# Altium schematic sheet [2] MCU.SchDoc
size A3; Author: Caner ALP; Organization: ALP Electronics; Address1: Axel Oxenstiernas; Address2: Västerås; Address3: 72478; Address4: Sweden; DocumentNumber: 2; SheetNumber: 2; SheetTotal: 7
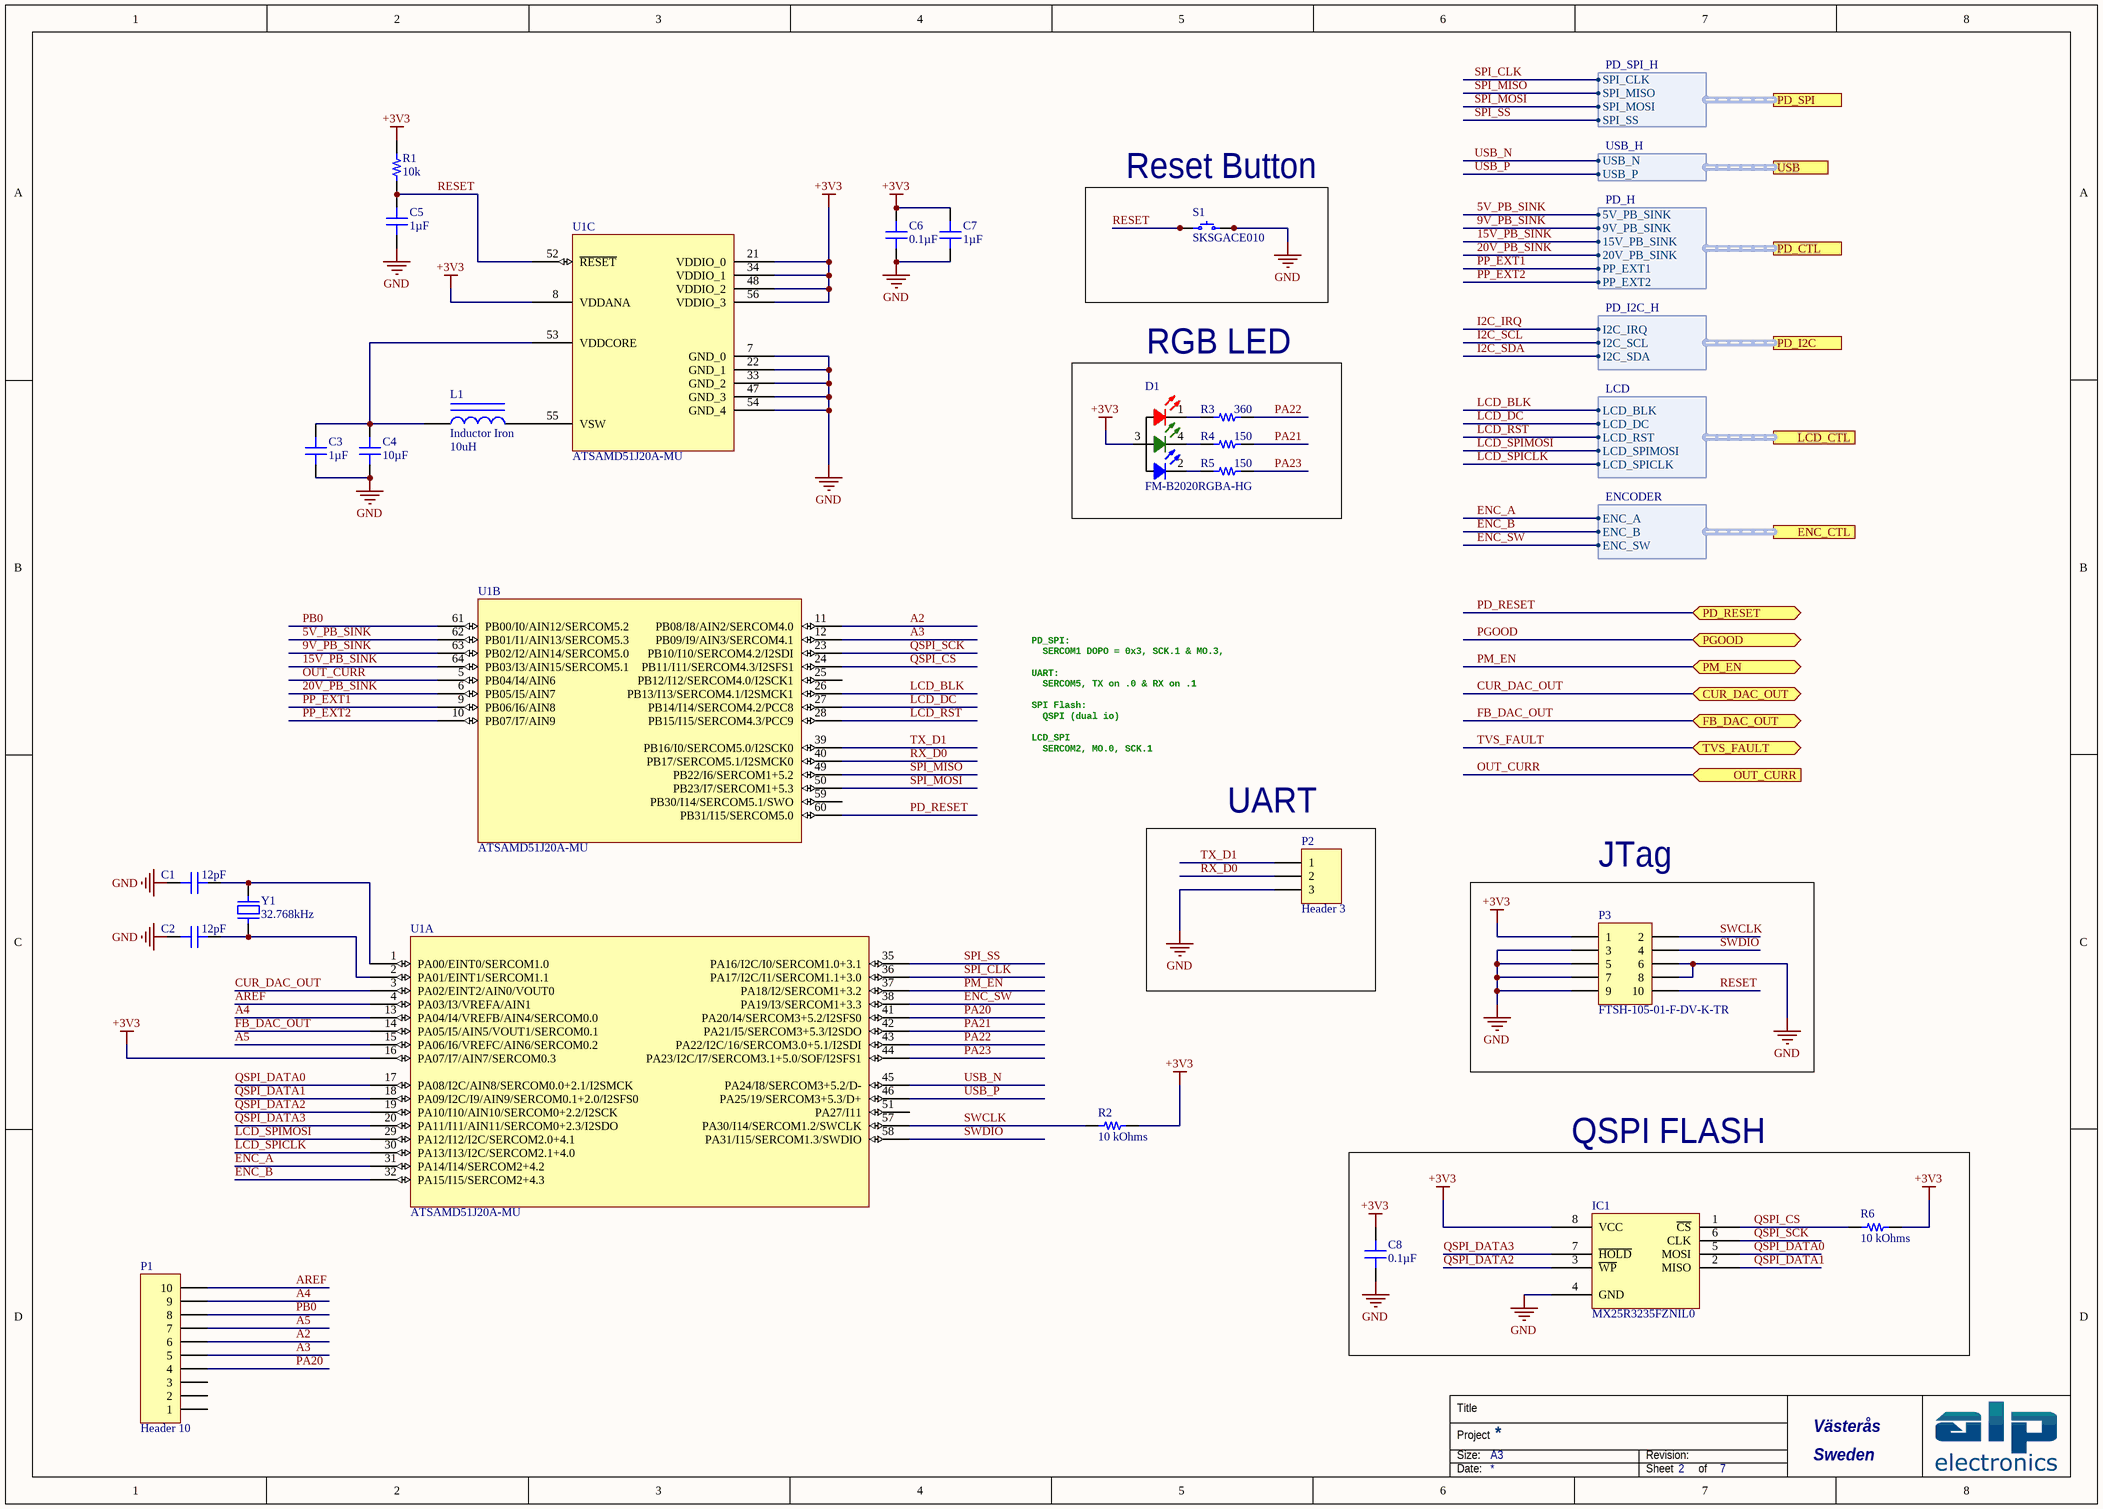
[diagram p0: [2] MCU.SchDoc]

## Parts
C1  12pF  [CAP 0603_1608]
C2  12pF  [CAP 0603_1608]
C3  1µF  [CAP 0603_1608]
C4  10µF  [CAP 0603_1608]
C5  1µF  [CAP 0603_1608]
C6  0.1µF  [CAP 0603_1608]
C7  1µF  [CAP 0603_1608]
C8  0.1µF  [CAP 0603_1608]
D1  FM-B2020RGBA-HG  [FM-B2020RGBA-HG]
IC1  MX25R3235FZNIL0  [SPANSION WSON-8 6x5MM]
L1  Inductor Iron  value 10uH  [IND_Würth_74404020100]
P1  Header 10  [HDR1X10]
P2  Header 3  [HDR1X3]
P3  FTSH-105-01-F-DV-K-TR  [FTSH-105-01-F-DV-K-TR]
R1  10k  [RES 0603/1608]
R2  10 kOhms  [RES 0603_1608]
R3  360  [RES 0603/1608]
R4  150  [RES 0603/1608]
R5  150  [RES 0603/1608]
R6  10 kOhms  [RES 0603_1608]
S1  SKSGACE010  [SKSGACE010]
U1  ATSAMD51J20A-MU  [SI LABS QFN-64_S]  (parts A,B,C of 3)
Y1  32.768kHz  [ABRACON ABS07]

## Blocks framed on the sheet
Reset Button: S1
RGB LED: D1 R3-R5
UART: P2
JTag: P3
QSPI FLASH: C8 IC1 R6

## Ports
CUR_DAC_OUT (bidir), ENC_CTL (harness ENCODER), FB_DAC_OUT (bidir), LCD_CTL (harness LCD), OUT_CURR (in), PD_CTL (harness PD_H), PD_I2C (harness PD_I2C_H), PD_RESET (bidir), PD_SPI (harness PD_SPI_H), PGOOD (bidir), PM_EN (bidir), TVS_FAULT (bidir), USB (harness USB_H)

## Harnesses
USB_H: USB_N, USB_P
PD_H: 5V_PB_SINK, 9V_PB_SINK, 15V_PB_SINK, 20V_PB_SINK, PP_EXT1, PP_EXT2
PD_SPI_H: SPI_CLK, SPI_MISO, SPI_MOSI, SPI_SS
PD_I2C_H: I2C_IRQ, I2C_SCL, I2C_SDA
LCD: LCD_BLK, LCD_DC, LCD_RST, LCD_SPIMOSI, LCD_SPICLK
ENCODER: ENC_A, ENC_B, ENC_SW

## Nets
+3V3: C6.1 C7.2 C8.1 D1.3 IC1.8(VCC) P3.1 R1.2 R2.2 R6.2 U1.8(VDDANA) U1.16(PA07/I7/AIN7/SERCOM0.3) U1.21(VDDIO_0) U1.34(VDDIO_1) U1.48(VDDIO_2) U1.56(VDDIO_3)
GND: C1.1 C2.1 C3.1 C4.1 C5.1 C6.2 C7.1 C8.2 IC1.4(GND) P2.3 P3.3 P3.5 P3.6 P3.7 P3.8 P3.9 S1.3 S1.4 U1.7(GND_0) U1.22(GND_1) U1.33(GND_2) U1.47(GND_3) U1.54(GND_4)
5V_PB_SINK: U1.62(PB01/I1/AIN13/SERCOM5.3) ; port PD_CTL.5V_PB_SINK
9V_PB_SINK: U1.63(PB02/I2/AIN14/SERCOM5.0) ; port PD_CTL.9V_PB_SINK
15V_PB_SINK: U1.64(PB03/I3/AIN15/SERCOM5.1) ; port PD_CTL.15V_PB_SINK
20V_PB_SINK: U1.6(PB05/I5/AIN7) ; port PD_CTL.20V_PB_SINK
A2: P1.6 U1.11(PB08/I8/AIN2/SERCOM4.0)
A3: P1.5 U1.12(PB09/I9/AIN3/SERCOM4.1)
A4: P1.9 U1.13(PA04/I4/VREFB/AIN4/SERCOM0.0)
A5: P1.7 U1.15(PA06/I6/VREFC/AIN6/SERCOM0.2)
AREF: P1.10 U1.4(PA03/I3/VREFA/AIN1)
CUR_DAC_OUT: U1.3(PA02/EINT2/AIN0/VOUT0) ; port CUR_DAC_OUT
ENC_A: U1.31(PA14/I14/SERCOM2+4.2) ; port ENC_CTL.ENC_A
ENC_B: U1.32(PA15/I15/SERCOM2+4.3) ; port ENC_CTL.ENC_B
ENC_SW: U1.38(PA19/I3/SERCOM1+3.3) ; port ENC_CTL.ENC_SW
FB_DAC_OUT: U1.14(PA05/I5/AIN5/VOUT1/SERCOM0.1) ; port FB_DAC_OUT
I2C_IRQ: port PD_I2C.I2C_IRQ
I2C_SCL: port PD_I2C.I2C_SCL
I2C_SDA: port PD_I2C.I2C_SDA
LCD_BLK: U1.26(PB13/I13/SERCOM4.1/I2SMCK1) ; port LCD_CTL.LCD_BLK
LCD_DC: U1.27(PB14/I14/SERCOM4.2/PCC8) ; port LCD_CTL.LCD_DC
LCD_RST: U1.28(PB15/I15/SERCOM4.3/PCC9) ; port LCD_CTL.LCD_RST
LCD_SPICLK: U1.30(PA13/I13/I2C/SERCOM2.1+4.0) ; port LCD_CTL.LCD_SPICLK
LCD_SPIMOSI: U1.29(PA12/I12/I2C/SERCOM2.0+4.1) ; port LCD_CTL.LCD_SPIMOSI
OUT_CURR: U1.5(PB04/I4/AIN6) ; port OUT_CURR
PA20: P1.4 U1.41(PA20/I4/SERCOM3+5.2/I2SFS0)
PA21: R4.2 U1.42(PA21/I5/SERCOM3+5.3/I2SDO)
PA22: R3.2 U1.43(PA22/I2C/16/SERCOM3.0+5.1/I2SDI)
PA23: R5.2 U1.44(PA23/I2C/I7/SERCOM3.1+5.0/SOF/I2SFS1)
PB0: P1.8 U1.61(PB00/I0/AIN12/SERCOM5.2)
PD_RESET: U1.60(PB31/I15/SERCOM5.0) ; port PD_RESET
PGOOD: port PGOOD
PM_EN: U1.37(PA18/I2/SERCOM1+3.2) ; port PM_EN
PP_EXT1: U1.9(PB06/I6/AIN8) ; port PD_CTL.PP_EXT1
PP_EXT2: U1.10(PB07/I7/AIN9) ; port PD_CTL.PP_EXT2
QSPI_CS: IC1.1(~{CS}) R6.1 U1.24(PB11/I11/SERCOM4.3/I2SFS1)
QSPI_DATA0: IC1.5(MOSI) U1.17(PA08/I2C/AIN8/SERCOM0.0+2.1/I2SMCK)
QSPI_DATA1: IC1.2(MISO) U1.18(PA09/I2C/I9/AIN9/SERCOM0.1+2.0/I2SFS0)
QSPI_DATA2: IC1.3(~{WP}) U1.19(PA10/I10/AIN10/SERCOM0+2.2/I2SCK)
QSPI_DATA3: IC1.7(~{HOLD}) U1.20(PA11/I11/AIN11/SERCOM0+2.3/I2SDO)
QSPI_SCK: IC1.6(CLK) U1.23(PB10/I10/SERCOM4.2/I2SDI)
RESET: C5.2 P3.10 R1.1 S1.1 S1.2 U1.52(~{RESET})
RX_D0: P2.2 U1.40(PB17/SERCOM5.1/I2SMCK0)
SPI_CLK: U1.36(PA17/I2C/I1/SERCOM1.1+3.0) ; port PD_SPI.SPI_CLK
SPI_MISO: U1.49(PB22/I6/SERCOM1+5.2) ; port PD_SPI.SPI_MISO
SPI_MOSI: U1.50(PB23/I7/SERCOM1+5.3) ; port PD_SPI.SPI_MOSI
SPI_SS: U1.35(PA16/I2C/I0/SERCOM1.0+3.1) ; port PD_SPI.SPI_SS
SWCLK: P3.2 R2.1 U1.57(PA30/I14/SERCOM1.2/SWCLK)
SWDIO: P3.4 U1.58(PA31/I15/SERCOM1.3/SWDIO)
TVS_FAULT: port TVS_FAULT
TX_D1: P2.1 U1.39(PB16/I0/SERCOM5.0/I2SCK0)
USB_N: U1.45(PA24/I8/SERCOM3+5.2/D-) ; port USB.USB_N
USB_P: U1.46(PA25/19/SERCOM3+5.3/D+) ; port USB.USB_P
NetC1_2: C1.2 U1.1(PA00/EINT0/SERCOM1.0) Y1.2
NetC2_2: C2.2 U1.2(PA01/EINT1/SERCOM1.1) Y1.1
NetC3_2: C3.2 C4.2 L1.1 U1.53(VDDCORE)
NetD1_1: D1.1 R3.1
NetD1_2: D1.2 R5.1
NetD1_4: D1.4 R4.1
NetL1_2: L1.2 U1.55(VSW)

Not connected (* = marked no-connect by the designer): P1 1 2 3; U1 25(PB12/I12/SERCOM4.0/I2SCK1) 51(PA27/I11) 59(PB30/I14/SERCOM5.1/SWO)

## Notes on the sheet
- PD_SPI:
  SERCOM1 DOPO = 0x3, SCK.1 & MO.3,
  UART:
  SERCOM5, TX on .0 & RX on .1
  SPI Flash:
  QSPI (dual io)
  LCD_SPI
  SERCOM2, MO.0, SCK.1
- Title
- Size:
- Project
- A3
- Revision:
- Date:
- Sheet
- of

## Library data of the parts
C1 C2 = 06031A120JAT4A: CAP CER 12PF 100V NP0 0603; Manufacturer: AVX Corporation; Temperature Coefficient: C0G, NP0; Tolerance: ±5%; Part Number: 06031A120JAT4A; Value: 12pF; Applications: General Purpose; Capacitance: 12pF; ComponentLink1Description: Datasheet; ComponentLink1URL: http://datasheets.avx.com/C0GNP0-Dielectric.pdf; ComponentLink2Description: DigiKey Link; ComponentLink2URL: http://digikey.com/product-detail/en/avx-corporation/06031A120JAT4A/478-10188-1-ND/6797488; Device Package: 0603 (1608 Metric); LastUpdated: 21/01/2020 00:01:49; Lifecycle Status: Active; Minimum Order: 1; Mounting Type: Surface Mount, MLCC; Operating Temperature: -55°C ~ 125°C; Package / Case: 0603 (1608 Metric); Packaging: TapeAndReel; PartId: 14161; Part Status: Active; Price: 0.01; Series: -; Size / Dimension: 0.063" L x 0.032" W (1.60mm x 0.81mm); Supplier 1: DigiKey; Supplier Part Number 1: 478-10188-1-ND; Thickness (Max): 0.035" (0.90mm); Voltage - Rated: 100V
C3 C5 = 06035C105KAT2A: CAP CER 1UF 50V X7R 0603; Manufacturer: AVX Corporation; Tolerance: ±10%; Part Number: 06035C105KAT2A; Value: 1µF; Applications: General Purpose; Capacitance: 1µF; ComponentLink1Description: Datasheet; ComponentLink1URL: http://datasheets.avx.com/X7RDielectric.pdf; ComponentLink2Description: DigiKey Link; ComponentLink2URL: http://digikey.com/product-detail/en/avx-corporation/06035C105KAT2A/478-10073-1-ND/6564295; Device Package: 0603 (1608 Metric); LastUpdated: 21/01/2020 00:02:08; Lifecycle Status: Active; Minimum Order: 1; Mounting Type: Surface Mount, MLCC; Operating Temperature: -55°C ~ 125°C; Package / Case: 0603 (1608 Metric); Packaging: TapeAndReel; PartId: 2905; Part Status: Active; Price: 0.15; Series: -; Size / Dimension: 0.063" L x 0.032" W (1.60mm x 0.81mm); Supplier 1: DigiKey; Supplier Part Number 1: 478-10073-1-ND; Temperature Coefficient: X7R; Thickness (Max): 0.020" (0.50mm); Voltage - Rated: 50V
C4 = 0603ZD106MAT2A: CAP CER 10UF 10V X5R 0603; Manufacturer: AVX Corporation; Tolerance: ±20%; Part Number: 0603ZD106MAT2A; Value: 10µF; Applications: General Purpose; Capacitance: 10µF; ComponentLink1Description: Datasheet; ComponentLink1URL: http://datasheets.avx.com/cx5r.pdf; ComponentLink2Description: DigiKey Link; ComponentLink2URL: http://digikey.com/product-detail/en/avx-corporation/0603ZD106MAT2A/478-8050-1-ND/3900666; Device Package: 0603 (1608 Metric); LastUpdated: 21/01/2020 00:01:55; Lifecycle Status: Active; Minimum Order: 1; Mounting Type: Surface Mount, MLCC; Operating Temperature: -55°C ~ 85°C; Package / Case: 0603 (1608 Metric); Packaging: TapeAndReel; PartId: 11464; Part Status: Active; Price: 0.18; Series: -; Size / Dimension: 0.063" L x 0.032" W (1.60mm x 0.81mm); Supplier 1: DigiKey; Supplier Part Number 1: 478-8050-1-ND; Temperature Coefficient: X5R; Thickness (Max): 0.035" (0.90mm); Voltage - Rated: 10V
C6 C8 = 0603BB104K500NGT: CAP CER 0.1UF 50V X7R 0603; Manufacturer: Knowles Novacap; Tolerance: ±10%; Part Number: 0603BB104K500NGT; Value: 0.1µF; Applications: General Purpose; Capacitance: 0.1µF; ComponentLink1Description: Datasheet; ComponentLink1URL: https://www.knowlescapacitors.com/getattachment/6c8d48ef-fc2b-4752-ae2c-ce6c208de0c4/High-Capacitance-Chip.aspx; ComponentLink2Description: DigiKey Link; ComponentLink2URL: http://digikey.com/product-detail/en/knowles-novacap/0603BB104K500NGT/1763-1146-1-ND/7304094; Device Package: 0603 (1608 Metric); Features: Gold Flash Termination; LastUpdated: 21/01/2020 00:02:02; Lifecycle Status: Active; Minimum Order: 1; Mounting Type: Surface Mount, MLCC; Operating Temperature: -55°C ~ 125°C; Package / Case: 0603 (1608 Metric); Packaging: TapeAndReel; PartId: 7006; Part Status: Active; Price: 0.56; Series: -; Size / Dimension: 0.060" L x 0.030" W (1.52mm x 0.76mm); Supplier 1: DigiKey; Supplier Part Number 1: 1763-1146-1-ND; Temperature Coefficient: X7R; Thickness (Max): 0.035" (0.89mm); Voltage - Rated: 50V
C7 = 0603BB105K160YT: CAP CER 1UF 16V X7R 0603; Manufacturer: Knowles Novacap; Tolerance: ±10%; Part Number: 0603BB105K160YT; Value: 1µF; Applications: General Purpose; Capacitance: 1µF; ComponentLink1Description: Datasheet; ComponentLink1URL: https://www.knowlescapacitors.com/getattachment/6c8d48ef-fc2b-4752-ae2c-ce6c208de0c4/High-Capacitance-Chip.aspx; ComponentLink2Description: DigiKey Link; ComponentLink2URL: http://digikey.com/product-detail/en/knowles-novacap/0603BB105K160YT/1763-1175-1-ND/7304294; Device Package: 0603 (1608 Metric); LastUpdated: 21/01/2020 00:02:02; Lifecycle Status: Active; Minimum Order: 1; Mounting Type: Surface Mount, MLCC; Operating Temperature: -55°C ~ 125°C; Package / Case: 0603 (1608 Metric); Packaging: TapeAndReel; PartId: 6996; Part Status: Active; Price: 0.51; Series: -; Size / Dimension: 0.060" L x 0.030" W (1.52mm x 0.76mm); Supplier 1: DigiKey; Supplier Part Number 1: 1763-1175-1-ND; Temperature Coefficient: X7R; Thickness (Max): 0.035" (0.89mm); Voltage - Rated: 16V
D1 = FM-B2020RGBA-HG: RGB 615~630nmRed,515~535nmGreen,465~480nmBlue 2020; Manufacturer: Foshan NationStar Optoelectronics; Value: Green; Type: Surface Mount; Part Number: FM-B2020RGBA-HG; PartId: 10872; Supplier 1: LCSC; Supplier Part Number 1: C108793; ComponentLink1Description: Datasheet; ComponentLink1URL: https://datasheet.lcsc.com/szlcsc/1810231210_Foshan-NationStar-Optoelectronics-FM-B2020RGBA-HG_C108793.pdf; ComponentLink2Description: LCSC Listing; ComponentLink2URL: https://lcsc.com/product-detail/Light-Emitting-Diodes-LED_FM-B2020RGBA-HG_C108793.html; Device Package: 2020; Colour: RGB
IC1 = S25FL116K0XNFI011: IC FLASH MEM 16MB SPI CMOS 8WSON; Manufacturer: Spansion; Memory Type: FLASH - NOR; Memory Size: 16M (2M x 8); Speed: 108MHz; Interface: SPI Serial; Voltage - Supply: 2.7 V ~ 3.6 V; Part Number: S25FL116K0XNFI011; PartId: 8258; Supplier 1: Digi-Key; Supplier Part Number 1: 1274-1131-ND; ComponentLink1Description: Datasheet; ComponentLink1URL: http://www.spansion.com/Support/Datasheets/S25FL1-K_00.pdf; ComponentLink2Description: Digi-Key Listing; ComponentLink2URL: http://www.digikey.com/product-detail/en/S25FL116K0XNFI011/1274-1131-ND/4517162; Price: 0,49; Type: FLASH - NOR; Device Package: 8-WDFN Exposed Pad; Operating Temperature: -40C ~ 85C
L1 = Inductor Iron: Magnetic-Core Inductor; Published: 24-Mar-1999; LatestRevisionDate: 17-Jul-2002; LatestRevisionNote: Re-released for DXP Platform.; PackageReference: AXIAL-0.9; Publisher: Altium Limited; PackageDescription: Axial Device, Thru-Hole; 2 Leads; 0.9 in Pin Spacing
P1 = Header 10: Header, 10-Pin; LatestRevisionDate: 17-Jul-2002; LatestRevisionNote: Re-released for DXP Platform.; Publisher: Altium Limited
P2 = Header 3: Header, 3-Pin; LatestRevisionDate: 17-Jul-2002; LatestRevisionNote: Re-released for DXP Platform.; Publisher: Altium Limited
P3 = Header 5X2: Header, 5-Pin, Dual row; LatestRevisionDate: 17-Jul-2002; LatestRevisionNote: Re-released for DXP Platform.; Publisher: Altium Limited
R1 = ERJ-3GEYJ103V: RES SMD 10K OHM 5% 1/10W 0603; Manufacturer: Panasonic Electronic Components; TemperatureRange: -55C ~ 155C; TemperatureCoefficient: 200ppm/C; PowerRating: 0.1W, 1/10W; Value: 10k; Part Number: ERJ-3GEYJ103V; PartId: 11175; Supplier 1: Digi-Key; Supplier Part Number 1: P10KGTR-ND; ComponentLink1Description: Datasheet; ComponentLink1URL: http://industrial.panasonic.com/www-cgi/jvcr13pz.cgi?E+PZ+3+AOA0001+ERJ3GEYJ103V+7+WW; ComponentLink2Description: Digi-Key Listing; ComponentLink2URL: https://www.digikey.com/product-detail/en/panasonic-electronic-components/ERJ-3GEYJ103V/P10KGTR-ND/135662; Tolerance: 5%; Price: 0.002; Device Package: 0603 (1608 Metric)
R2 R6 = CRCW060310K0JNEA: RES SMD 10K OHM 5% 1/10W 0603; Manufacturer: Vishay Dale; Power (Watts): 0.1W, 1/10W; Temperature Coefficient: ±200ppm/°C; Part Number: CRCW060310K0JNEA; Value: 10 kOhms; ComponentLink1Description: Datasheet; ComponentLink1URL: http://www.vishay.com/docs/20035/dcrcwe3.pdf; ComponentLink2Description: DigiKey Link; ComponentLink2URL: http://digikey.com/product-detail/en/vishay-dale/CRCW060310K0JNEA/541-10KGCT-ND/1179393; Composition: Thick Film; Device Package: 0603 (1608 Metric); Features: Automotive AEC-Q200; Height - Seated (Max): 0.020" (0.50mm); LastUpdated: 21/01/2020 00:24:50; Lifecycle Status: Active; Minimum Order: 1; Number of Terminations: 2; Operating Temperature: -55°C ~ 155°C; Package / Case: 0603 (1608 Metric); Packaging: CutTape; PartId: 5216; Part Status: Active; Price: 0.10; Ratings: AEC-Q200; Resistance: 10 kOhms; Series: CRCW; Size / Dimension: 0.063" L x 0.033" W (1.60mm x 0.85mm); Supplier 1: DigiKey; Supplier Part Number 1: 541-10KGCT-ND; Supplier Device Package: 0603; Tolerance: ±5%
R3 = ERJ-3GEYJ361V: RES SMD 360 OHM 5% 1/10W 0603; Manufacturer: Panasonic Electronic Components; TemperatureRange: -55C ~ 155C; TemperatureCoefficient: 200ppm/C; PowerRating: 0.1W, 1/10W; Value: 360; Part Number: ERJ-3GEYJ361V; PartId: 11239; Supplier 1: Digi-Key; Supplier Part Number 1: P360GTR-ND; ComponentLink1Description: Datasheet; ComponentLink1URL: http://industrial.panasonic.com/www-cgi/jvcr13pz.cgi?E+PZ+3+AOA0001+ERJ3GEYJ361V+7+WW; ComponentLink2Description: Digi-Key Listing; ComponentLink2URL: https://www.digikey.com/product-detail/en/panasonic-electronic-components/ERJ-3GEYJ361V/P360GTR-ND/135761; Tolerance: 5%; Price: 0.002; Device Package: 0603 (1608 Metric)
R4 R5 = ERJ-3GEYJ151V: RES SMD 150 OHM 5% 1/10W 0603; Manufacturer: Panasonic Electronic Components; TemperatureRange: -55C ~ 155C; TemperatureCoefficient: 200ppm/C; PowerRating: 0.1W, 1/10W; Value: 150; Part Number: ERJ-3GEYJ151V; PartId: 11200; Supplier 1: Digi-Key; Supplier Part Number 1: P150GTR-ND; ComponentLink1Description: Datasheet; ComponentLink1URL: http://industrial.panasonic.com/www-cgi/jvcr13pz.cgi?E+PZ+3+AOA0001+ERJ3GEYJ151V+7+WW; ComponentLink2Description: Digi-Key Listing; ComponentLink2URL: https://www.digikey.com/product-detail/en/panasonic-electronic-components/ERJ-3GEYJ151V/P150GTR-ND/135689; Tolerance: 5%; Price: 0.002; Device Package: 0603 (1608 Metric)
S1 = SKSGACE010: SWITCH TACTILE SPST-NO 0.05A 16V; Manufacturer: ALPS; Part Number: SKSGACE010; PartId: 16471; Supplier 1: Mouser; Supplier Part Number 1: 688-SKSGACE010; ComponentLink1Description: Datasheet; ComponentLink1URL: https://www.mouser.se/datasheet/2/15/SKSG-1370727.pdf; ComponentLink2Description: Mouser Listing; ComponentLink2URL: https://www.mouser.se/ProductDetail/ALPS/SKSGACE010?qs=Ptl%2FSkKmb3BEFq%252BG855%2Fog==
U1 = ATSAMD51J20A-MU: IC MCU 32BIT 1MB FLASH 64VQFN; Manufacturer: Microchip Technology; Core Processor: ARM Cortex-M4; Part Number: ATSAMD51J20A-MU; PartId: 10980; Supplier 1: Digi-Key; Supplier Part Number 1: ATSAMD51J20A-MU-ND; ComponentLink1Description: Datasheet; ComponentLink1URL: http://ww1.microchip.com/downloads/en/DeviceDoc/60001507E.pdf; ComponentLink2Description: Digi-Key Listing; ComponentLink2URL: https://www.digikey.com/product-detail/en/microchip-technology/ATSAMD51J20A-MU/ATSAMD51J20A-MU-ND/7390352; Device Package: 64-VFQFN Exposed Pad
Y1 = ABS07-32.768KHZ-T: CRYSTAL 32.7680KHZ 12.5PF SMD; Manufacturer: Abracon LLC; Frequency Tolerance: 20ppm; ESR: 70 kOhm; Operating Mode: Fundamental; Part Number: ABS07-32.768KHZ-T; PartId: 8487; Supplier 1: Digi-Key; Supplier Part Number 1: 535-9542-2-ND; ComponentLink1Description: Datasheet; ComponentLink1URL: http://www.abracon.com/Resonators/ABS07.pdf; ComponentLink2Description: Digi-Key Listing; ComponentLink2URL: http://www.digikey.com/product-detail/en/ABS07-32.768KHZ-T/535-9542-2-ND/1236858; Price: 0,3; Type: kHz Crystal (Tuning Fork); Device Package: 2-SMD; Frequency: 32.768kHz; Frequency Stability: -; Load Capacitance: 12.5pF